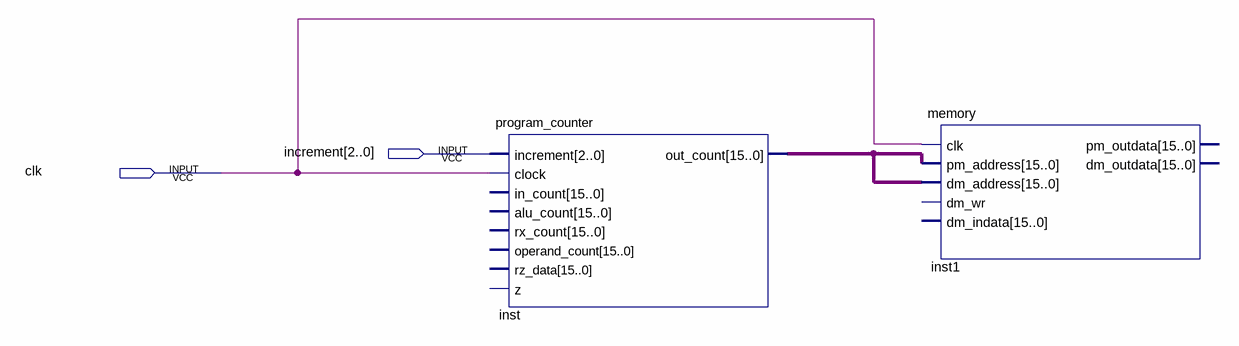
[diagram p0: schematic sheet]
// Quartus schematic instructionFetchTest.bdf as structural Verilog: 2 symbols, 2 pins
module instructionFetchTest (
  input  [2:0] increment,
  input  clk
);

  wire [15:0] inst_out_count;

  program_counter inst (
    .increment(increment), .clock(clk), .out_count(inst_out_count));  // open: in_count, alu_count, rx_count, operand_count, rz_data, z
  memory inst1 (
    .clk(clk), .pm_address(inst_out_count), .dm_address(inst_out_count));  // open: dm_wr, dm_indata, pm_outdata, dm_outdata
endmodule
